# Altium project PCB_Project.PrjPcb
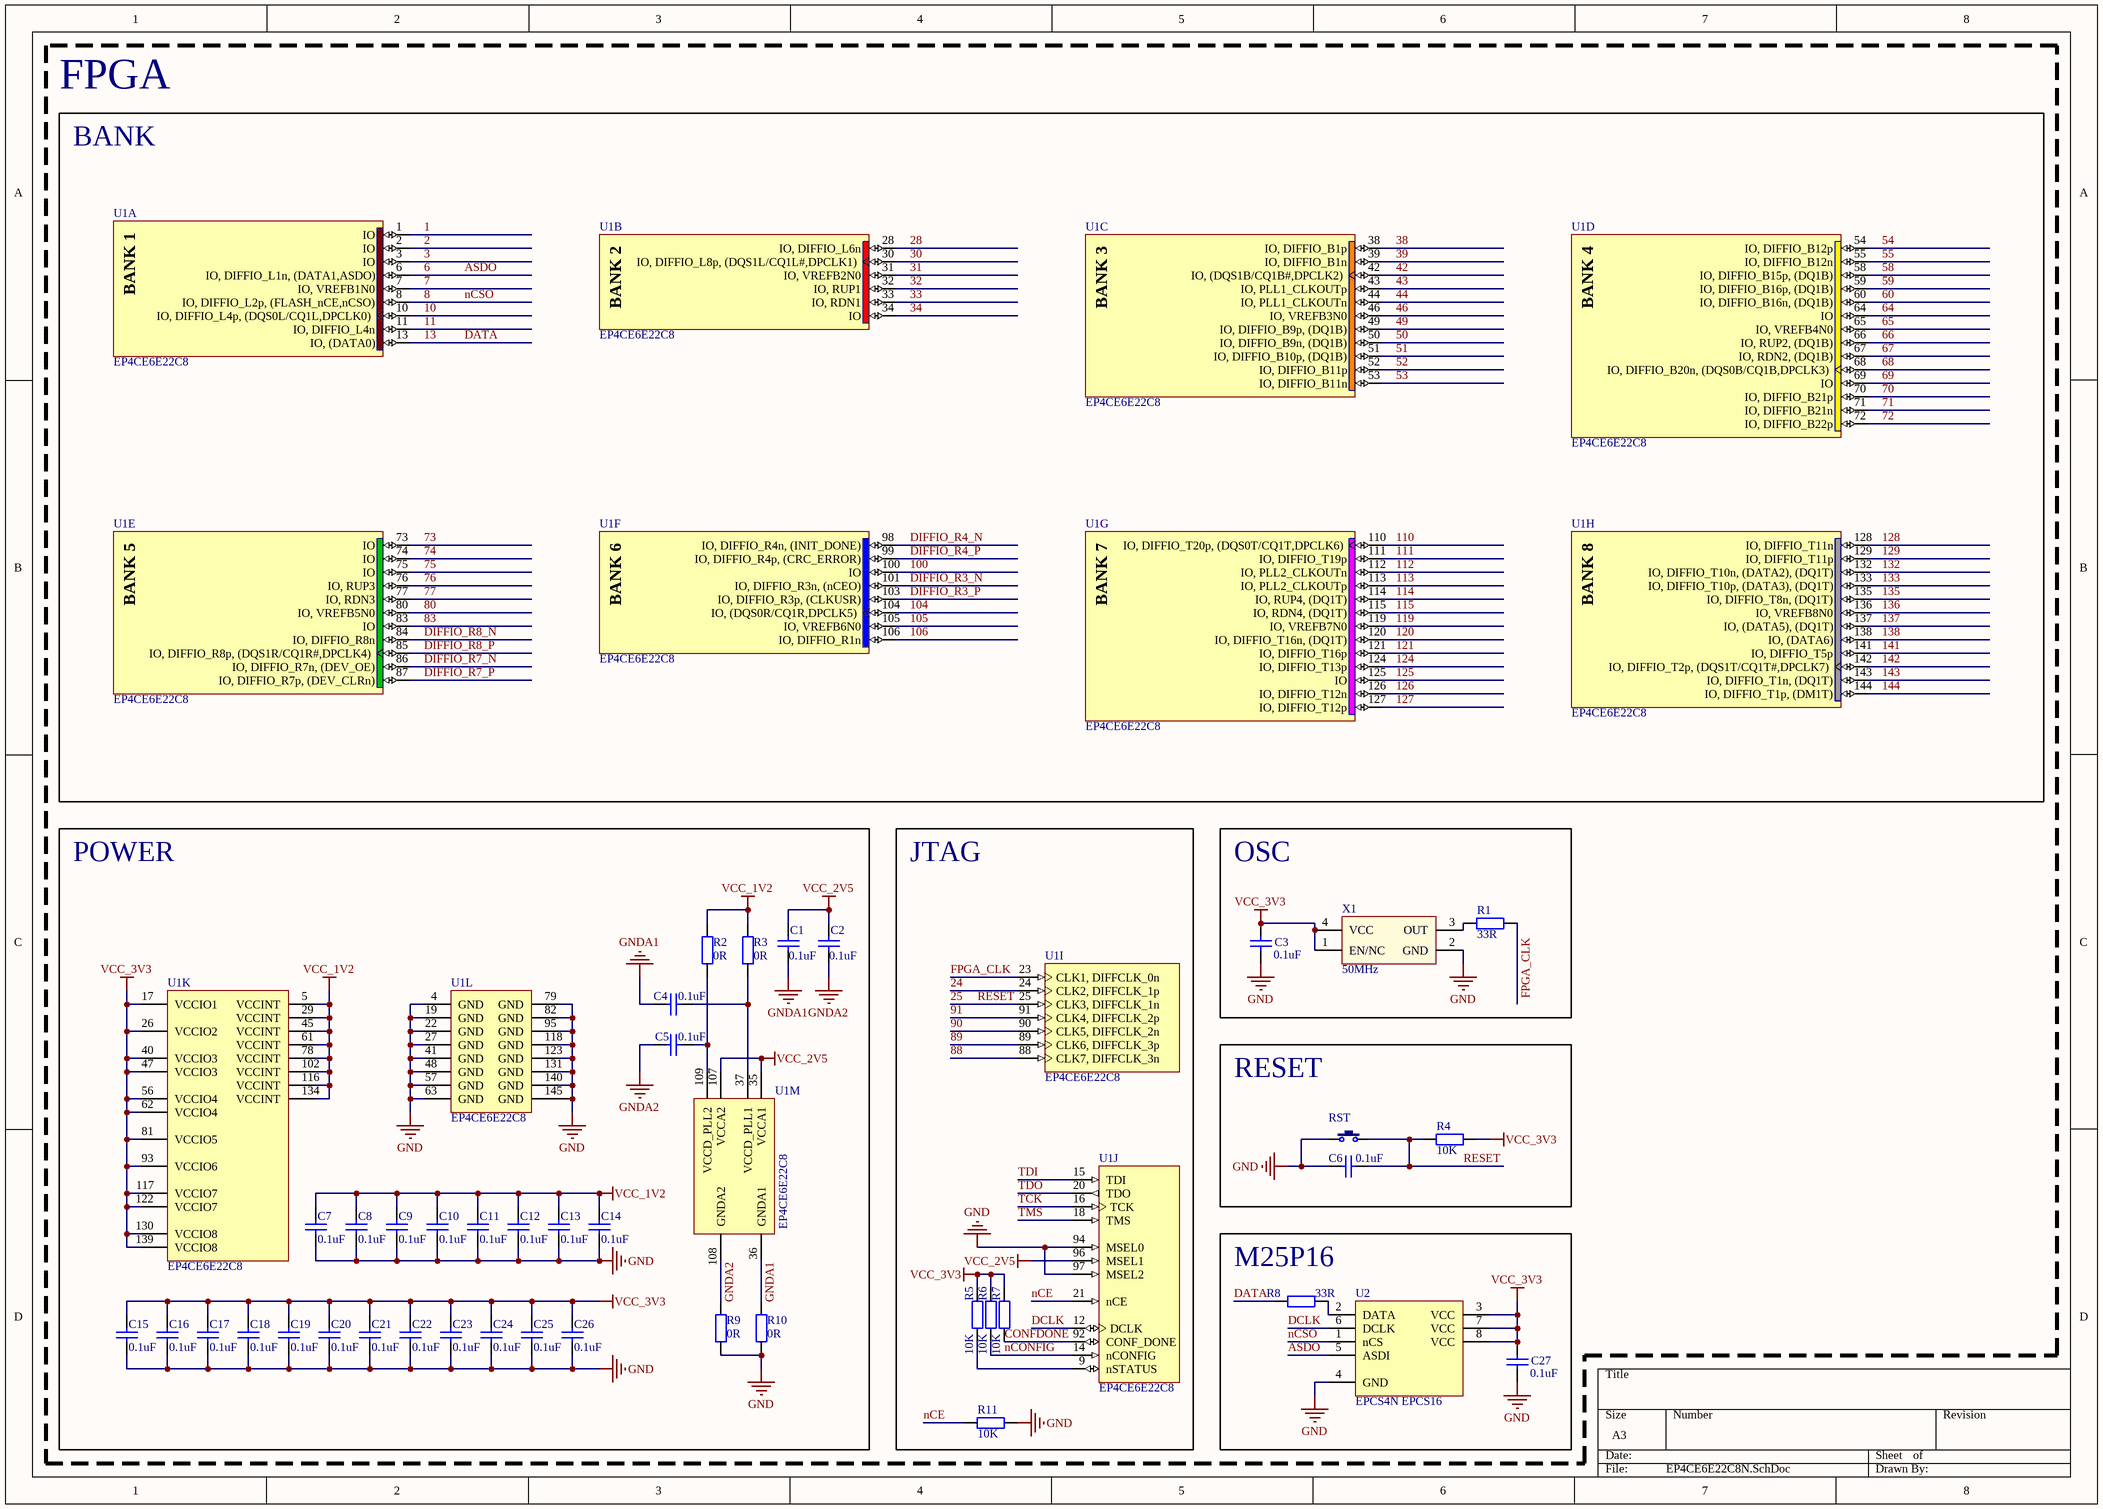
[diagram p0: EP4CE6E22C8N.SchDoc]
5 sheets, 156 parts. Net scope: global (net labels, ports and power ports of the same name join across sheets).
Board file: FPGA_PCB.PcbDoc
Sheets:
  EP4CE6E22C8N.SchDoc
  DDR_HDMI.SchDoc
  Power.SchDoc
  USB_Blaster.SchDoc
  Peripheral.SchDoc

## Sheet EP4CE6E22C8N.SchDoc
size A3; SheetNumber: 1; SheetTotal: 5

### Parts
C1  0.1uF  [0402_C]
C2  0.1uF  [0402_C]
C3  0.1uF  [0402_C]
C4  0.1uF  [0402_C]
C5  0.1uF  [0402_C]
C6  0.1uF  [0402_C]
C7  0.1uF  [0402_C]
C8  0.1uF  [0402_C]
C9  0.1uF  [0402_C]
C10  0.1uF  [0402_C]
C11  0.1uF  [0402_C]
C12  0.1uF  [0402_C]
C13  0.1uF  [0402_C]
C14  0.1uF  [0402_C]
C15  0.1uF  [0402_C]
C16  0.1uF  [0402_C]
C17  0.1uF  [0402_C]
C18  0.1uF  [0402_C]
C19  0.1uF  [0402_C]
C20  0.1uF  [0402_C]
C21  0.1uF  [0402_C]
C22  0.1uF  [0402_C]
C23  0.1uF  [0402_C]
C24  0.1uF  [0402_C]
C25  0.1uF  [0402_C]
C26  0.1uF  [0402_C]
C27  0.1uF  [0402_C]
R1  33R  [0402_R]
R2  0R  [0603_R _MINI]
R3  0R  [0603_R _MINI]
R4  10K  [0402_R]
R5  10K  [0402_R]
R6  10K  [0402_R]
R7  10K  [0402_R]
R8  33R  [0402_R]
R9  0R  [0603_R _MINI]
R10  0R  [0603_R _MINI]
R11  10K  [0402_R]
RST  3x6x5  [SW]  (value not drawn)
U1  EP4CE6E22C8  [EQFP144 20X20_N]  (parts A,B,C,D,E,F,G,H,I,J,K,L,M of 13)
U2  EPCS4N EPCS16  [SOP8_M]
X1  50MHz  [OSC 7050-4P]

### Blocks framed on the sheet
FPGA: U1
POWER: C1 C2 C4 C5 C7-C26 R2 R3 R9 R10 U1
JTAG: R5-R7 R11 U1
OSC: C3 R1 X1
RESET: C6 R4 RST
M25P16: C27 R8 U2

### Nets
GND: C3.1 C6.1 C7.1 C8.1 C9.1 C10.1 C11.1 C12.1 C13.1 C14.1 C15.1 C16.1 C17.1 C18.1 C19.1 C20.1 C21.1 C22.1 C23.1 C24.1 C25.1 C26.1 C27.1 R9.2 R10.2 R11.2 RST.1 U1.4(GND) U1.19(GND) U1.22(GND) U1.27(GND) U1.41(GND) U1.48(GND) U1.57(GND) U1.63(GND) U1.79(GND) U1.82(GND) U1.94(MSEL0) U1.95(GND) U1.97(MSEL2) U1.118(GND) U1.123(GND) U1.131(GND) U1.140(GND) U1.145(GND) U2.4(GND) X1.2(GND)
GNDA1: C1.1 C4.1 R10.1 U1.36(GNDA1)
GNDA2: C2.1 C5.1 R9.1 U1.108(GNDA2)
VCC_1V2: C7.2 C8.2 C9.2 C10.2 C11.2 C12.2 C13.2 C14.2 R2.1 R3.1 U1.5(VCCINT) U1.29(VCCINT) U1.45(VCCINT) U1.61(VCCINT) U1.78(VCCINT) U1.102(VCCINT) U1.116(VCCINT) U1.134(VCCINT)
VCC_2V5: C1.2 C2.2 U1.35(VCCA1) U1.96(MSEL1) U1.107(VCCA2)
VCC_3V3: C3.2 C15.2 C16.2 C17.2 C18.2 C19.2 C20.2 C21.2 C22.2 C23.2 C24.2 C25.2 C26.2 C27.2 R4.2 R5.1 R6.1 R7.1 U1.17(VCCIO1) U1.26(VCCIO2) U1.40(VCCIO3) U1.47(VCCIO3) U1.56(VCCIO4) U1.62(VCCIO4) U1.81(VCCIO5) U1.93(VCCIO6) U1.117(VCCIO7) U1.122(VCCIO7) U1.130(VCCIO8) U1.139(VCCIO8) U2.3(VCC) U2.7(VCC) U2.8(VCC) X1.1(EN/NC) X1.4(VCC)
1: U1.1(IO)
2: U1.2(IO)
3: U1.3(IO)
6: U1.6(IO,_DIFFIO_L1n,_(DATA1,ASDO)) U2.5(ASDI)  [also labelled ASDO]
7: U1.7(IO,_VREFB1N0)
8: U1.8(IO,_DIFFIO_L2p,_(FLASH_nCE,nCSO)) U2.1(nCS)  [also labelled nCSO]
10: U1.10(IO,_DIFFIO_L4p,_(DQS0L/CQ1L,DPCLK0))
11: U1.11(IO,_DIFFIO_L4n)
13: R8.1 U1.13(IO,_(DATA0))  [also labelled DATA]
24: U1.24(CLK2,_DIFFCLK_1p)
25: C6.2 R4.1 RST.2 U1.25(CLK3,_DIFFCLK_1n)  [also labelled RESET]
28: U1.28(IO,_DIFFIO_L6n)
30: U1.30(IO,_DIFFIO_L8p,_(DQS1L/CQ1L#,DPCLK1))
31: U1.31(IO,_VREFB2N0)
32: U1.32(IO,_RUP1)
33: U1.33(IO,_RDN1)
34: U1.34(IO)
38: U1.38(IO,_DIFFIO_B1p)
39: U1.39(IO,_DIFFIO_B1n)
42: U1.42(IO,_(DQS1B/CQ1B#,DPCLK2))
43: U1.43(IO,_PLL1_CLKOUTp)
44: U1.44(IO,_PLL1_CLKOUTn)
46: U1.46(IO,_VREFB3N0)
49: U1.49(IO,_DIFFIO_B9p,_(DQ1B))
50: U1.50(IO,_DIFFIO_B9n,_(DQ1B))
51: U1.51(IO,_DIFFIO_B10p,_(DQ1B))
52: U1.52(IO,_DIFFIO_B11p)
53: U1.53(IO,_DIFFIO_B11n)
54: U1.54(IO,_DIFFIO_B12p)
55: U1.55(IO,_DIFFIO_B12n)
58: U1.58(IO,_DIFFIO_B15p,_(DQ1B))
59: U1.59(IO,_DIFFIO_B16p,_(DQ1B))
60: U1.60(IO,_DIFFIO_B16n,_(DQ1B))
64: U1.64(IO)
65: U1.65(IO,_VREFB4N0)
66: U1.66(IO,_RUP2,_(DQ1B))
67: U1.67(IO,_RDN2,_(DQ1B))
68: U1.68(IO,_DIFFIO_B20n,_(DQS0B/CQ1B,DPCLK3))
69: U1.69(IO)
70: U1.70(IO,_DIFFIO_B21p)
71: U1.71(IO,_DIFFIO_B21n)
72: U1.72(IO,_DIFFIO_B22p)
73: U1.73(IO)
74: U1.74(IO)
75: U1.75(IO)
76: U1.76(IO,_RUP3)
77: U1.77(IO,_RDN3)
80: U1.80(IO,_VREFB5N0)
83: U1.83(IO)
88: U1.88(CLK7,_DIFFCLK_3n)
89: U1.89(CLK6,_DIFFCLK_3p)
90: U1.90(CLK5,_DIFFCLK_2n)
91: U1.91(CLK4,_DIFFCLK_2p)
100: U1.100(IO)
104: U1.104(IO,_(DQS0R/CQ1R,DPCLK5))
105: U1.105(IO,_VREFB6N0)
106: U1.106(IO,_DIFFIO_R1n)
110: U1.110(IO,_DIFFIO_T20p,_(DQS0T/CQ1T,DPCLK6))
111: U1.111(IO,_DIFFIO_T19p)
112: U1.112(IO,_PLL2_CLKOUTn)
113: U1.113(IO,_PLL2_CLKOUTp)
114: U1.114(IO,_RUP4,_(DQ1T))
115: U1.115(IO,_RDN4,_(DQ1T))
119: U1.119(IO,_VREFB7N0)
120: U1.120(IO,_DIFFIO_T16n,_(DQ1T))
121: U1.121(IO,_DIFFIO_T16p)
124: U1.124(IO,_DIFFIO_T13p)
125: U1.125(IO)
126: U1.126(IO,_DIFFIO_T12n)
127: U1.127(IO,_DIFFIO_T12p)
128: U1.128(IO,_DIFFIO_T11n)
129: U1.129(IO,_DIFFIO_T11p)
132: U1.132(IO,_DIFFIO_T10n,_(DATA2),_(DQ1T))
133: U1.133(IO,_DIFFIO_T10p,_(DATA3),_(DQ1T))
135: U1.135(IO,_DIFFIO_T8n,_(DQ1T))
136: U1.136(IO,_VREFB8N0)
137: U1.137(IO,_(DATA5),_(DQ1T))
138: U1.138(IO,_(DATA6))
141: U1.141(IO,_DIFFIO_T5p)
142: U1.142(IO,_DIFFIO_T2p,_(DQS1T/CQ1T#,DPCLK7))
143: U1.143(IO,_DIFFIO_T1n,_(DQ1T))
144: U1.144(IO,_DIFFIO_T1p,_(DM1T))
CONFDONE: R7.2 U1.92(CONF_DONE)
DCLK: U1.12(DCLK) U2.6(DCLK)
DIFFIO_R3_N: U1.101(IO,_DIFFIO_R3n,_(nCEO))
DIFFIO_R3_P: U1.103(IO,_DIFFIO_R3p,_(CLKUSR))
DIFFIO_R4_N: U1.98(IO,_DIFFIO_R4n,_(INIT_DONE))
DIFFIO_R4_P: U1.99(IO,_DIFFIO_R4p,_(CRC_ERROR))
DIFFIO_R7_N: U1.86(IO,_DIFFIO_R7n,_(DEV_OE))
DIFFIO_R7_P: U1.87(IO,_DIFFIO_R7p,_(DEV_CLRn))
DIFFIO_R8_N: U1.84(IO,_DIFFIO_R8n)
DIFFIO_R8_P: U1.85(IO,_DIFFIO_R8p,_(DQS1R/CQ1R#,DPCLK4))
FPGA_CLK: R1.2 U1.23(CLK1,_DIFFCLK_0n)
nCE: R11.1 U1.21(nCE)
nCONFIG: R6.2 U1.14(nCONFIG)
TCK: U1.16(TCK)  [project net JTAG_TCK]
TDI: U1.15(TDI)  [project net JTAG_TDI]
TDO: U1.20(TDO)  [project net JTAG_TDO]
TMS: U1.18(TMS)  [project net JTAG_TMS]
NetC4_2: C4.2 R3.2 U1.37(VCCD_PLL1)
NetC5_2: C5.2 R2.2 U1.109(VCCD_PLL2)
NetR1_1: R1.1 X1.3(OUT)
NetR5_2: R5.2 U1.9(nSTATUS)
NetR8_2: R8.2 U2.2(DATA)

### Notes on the sheet
- BANK
- (in symbol EP4CE6E22C8, part A) BANK 1
- (in symbol EP4CE6E22C8, part B) BANK 2
- (in symbol EP4CE6E22C8, part C) BANK 3
- (in symbol EP4CE6E22C8, part D) BANK 4
- (in symbol EP4CE6E22C8, part E) BANK 5
- (in symbol EP4CE6E22C8, part F) BANK 6
- (in symbol EP4CE6E22C8, part G) BANK 7
- (in symbol EP4CE6E22C8, part H) BANK 8

### Library data of the parts
C1-C27 = 0402_C: 贴片电容; ComponentLink1Description: 供应商链接; ComponentLink1URL: http://www.szlcsc.com/product/details_1928.html; Package: 0402; Supplier: LC; SuppliersPartNumber: C1576
R1 R4-R8 R11 = 0402_R: 贴片电阻; ComponentLink1Description: 供应商链接; ComponentLink1URL: http://www.szlcsc.com/product/details_26667.html; Package: 0402; Supplier: LC; SuppliersPartNumber: C25924
R2 R3 R9 R10 = 0603_R_MINI: 贴片电阻; ComponentLink1Description: 供应商链接; ComponentLink1URL: http://www.szlcsc.com/product/details_23987.html; Package: 0603; Supplier: LC; SuppliersPartNumber: C23260
RST = TSW 3x6: 3x6轻触开关; 版权归属: 源创客; BOM名称: 3x6轻触开关; 学习资源: www.ooocke.com
U1 = EP4CE6E22C8: Cyclone IV Family FPGA, 2V Core, 91 I/O Pins, 2 PLLs, 144-Pin QFP, Speed Grade 8, Commercial Grade; Published: 3-May-2010; DatasheetVersion: ver1.2, Mar-2010; PackageVersion: ver16.0, Dec-2009; PackageReference: EQFP144; Publisher: Altium Limited; PackageDescription: 144-Pin Plastic Enhanced Quad Flat Pack (EQFP144) - Wire Bond; Code_JEDEC: MS-026-BFB; ComponentLink1Description: Manufacturer Link; ComponentLink1URL: http://www.altera.com/; ComponentLink2Description: Handbook; ComponentLink2URL: http://www.altera.com/literature/hb/cyclone-iv/cyclone4-handbook.pdf; ComponentLink3Description: Pinout Specification; ComponentLink3URL: http://www.altera.com/literature/lit-dp.jsp?category=cyc%204&showspreadsheet=y; ComponentLink4Description: Packaging Specification; ComponentLink4URL: http://www.altera.com/literature/ds/dspkg.pdf
U2 = EPCS1
X1 = XTAL-ACT-4P: 4脚有源晶振; 版权归属: 源创客; BOM名称: 4脚有源晶振; 学习资源: www.ooocke.com

## Sheet DDR_HDMI.SchDoc
size A4; SheetNumber: 2; SheetTotal: 5
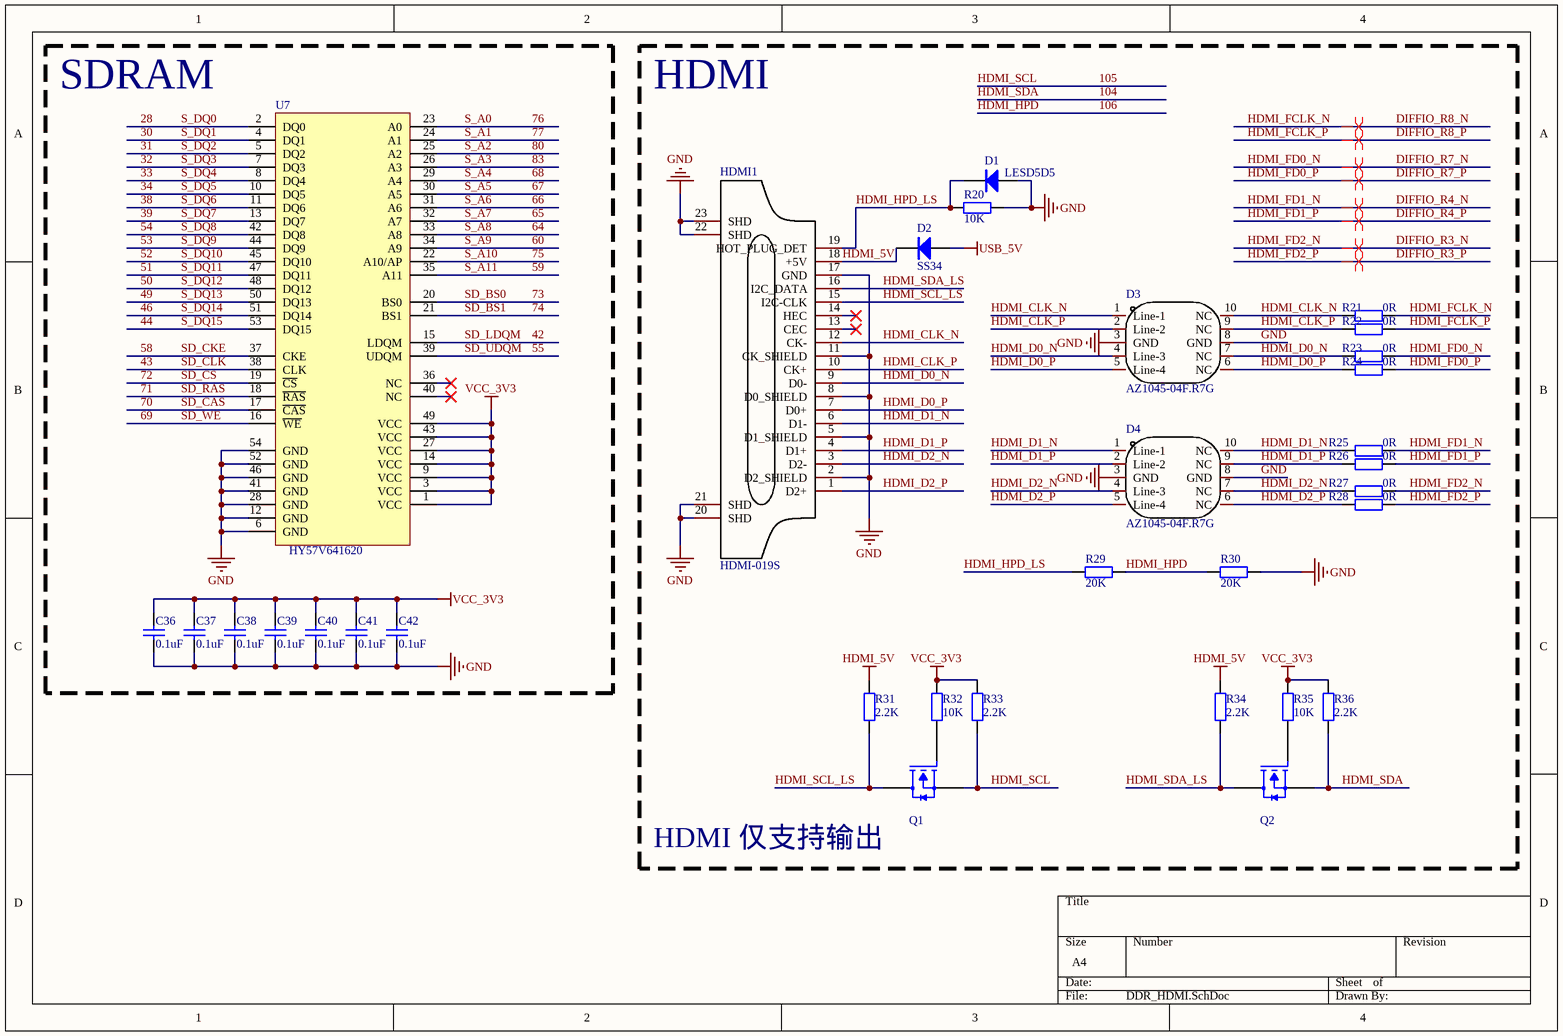
[diagram p1: DDR_HDMI.SchDoc]

### Parts
C36  0.1uF  [0402_C]
C37  0.1uF  [0402_C]
C38  0.1uF  [0402_C]
C39  0.1uF  [0402_C]
C40  0.1uF  [0402_C]
C41  0.1uF  [0402_C]
C42  0.1uF  [0402_C]
D1  LESD5D5  [SOD-523_L1.2-W0.8-LS1.6-RD]
D2  SS34  [SMC]
D3  AZ1045-04F.R7G  [DFN2510-10_L2.5-W1.0-P0.50-BL]
D4  AZ1045-04F.R7G  [DFN2510-10_L2.5-W1.0-P0.50-BL]
HDMI1  HDMI-019S  [HDMI-SMD_HDMI-019S]
Q1  AO3400A  [SOT23-3]  (value not drawn)
Q2  AO3400A  [SOT23-3]  (value not drawn)
R20  10K  [0402_R]
R21  0R  [0402_R]
R22  0R  [0402_R]
R23  0R  [0402_R]
R24  0R  [0402_R]
R25  0R  [0402_R]
R26  0R  [0402_R]
R27  0R  [0402_R]
R28  0R  [0402_R]
R29  20K  [0402_R]
R30  20K  [0402_R]
R31  2.2K  [0402_R]
R32  10K  [0402_R]
R33  2.2K  [0402_R]
R34  2.2K  [0402_R]
R35  10K  [0402_R]
R36  2.2K  [0402_R]
U7  HY57V641620  [TSOP-54_L22.2-W10.2-P0.80-LS11.8-BL]  (value not drawn)

### Blocks framed on the sheet
SDRAM: C36-C42 U7
HDMI: D1-D4 HDMI1 Q1 Q2 R20-R36

### Nets
GND: C36.1 C37.1 C38.1 C39.1 C40.1 C41.1 C42.1 D1.1(A) D3.3(GND) D3.8(GND) D4.3(GND) D4.8(GND) HDMI1.2(D2_SHIELD) HDMI1.5(D1_SHIELD) HDMI1.8(D0_SHIELD) HDMI1.11(CK_SHIELD) HDMI1.17(GND) HDMI1.20(SHD) HDMI1.21(SHD) HDMI1.22(SHD) HDMI1.23(SHD) R20.2 R30.2 U7.6(GND) U7.12(GND) U7.28(GND) U7.41(GND) U7.46(GND) U7.52(GND) U7.54(GND)
HDMI_5V: D2.2(K) HDMI1.18(+5V) R31.2 R34.2
USB_5V: D2.1(A)
VCC_3V3: C36.2 C37.2 C38.2 C39.2 C40.2 C41.2 C42.2 R32.2 R33.2 R35.2 R36.2 U7.1(VCC) U7.3(VCC) U7.9(VCC) U7.14(VCC) U7.27(VCC) U7.43(VCC) U7.49(VCC)
28: U7.2(DQ0)  [also labelled S_DQ0]
30: U7.4(DQ1)  [also labelled S_DQ1]
31: U7.5(DQ2)  [also labelled S_DQ2]
32: U7.7(DQ3)  [also labelled S_DQ3]
33: U7.8(DQ4)  [also labelled S_DQ4]
34: U7.10(DQ5)  [also labelled S_DQ5]
38: U7.11(DQ6)  [also labelled S_DQ6]
39: U7.13(DQ7)  [also labelled S_DQ7]
42: U7.15(LDQM)  [also labelled SD_LDQM]
43: U7.38(CLK)  [also labelled SD_CLK]
44: U7.53(DQ15)  [also labelled S_DQ15]
46: U7.51(DQ14)  [also labelled S_DQ14]
49: U7.50(DQ13)  [also labelled S_DQ13]
50: U7.48(DQ12)  [also labelled S_DQ12]
51: U7.47(DQ11)  [also labelled S_DQ11]
52: U7.45(DQ10)  [also labelled S_DQ10]
53: U7.44(DQ9)  [also labelled S_DQ9]
54: U7.42(DQ8)  [also labelled S_DQ8]
55: U7.39(UDQM)  [also labelled SD_UDQM]
58: U7.37(CKE)  [also labelled SD_CKE]
59: U7.35(A11)  [also labelled S_A11]
60: U7.34(A9)  [also labelled S_A9]
64: U7.33(A8)  [also labelled S_A8]
65: U7.32(A7)  [also labelled S_A7]
66: U7.31(A6)  [also labelled S_A6]
67: U7.30(A5)  [also labelled S_A5]
68: U7.29(A4)  [also labelled S_A4]
69: U7.16(~{WE})  [also labelled SD_WE]
70: U7.17(~{CAS})  [also labelled SD_CAS]
71: U7.18(~{RAS})  [also labelled SD_RAS]
72: U7.19(~{CS})  [also labelled SD_CS]
73: U7.20(BS0)  [also labelled SD_BS0]
74: U7.21(BS1)  [also labelled SD_BS1]
75: U7.22(A10/AP)  [also labelled S_A10]
76: U7.23(A0)  [also labelled S_A0]
77: U7.24(A1)  [also labelled S_A1]
80: U7.25(A2)  [also labelled S_A2]
83: U7.26(A3)  [also labelled S_A3]
104: Q2.2(S) R36.1  [also labelled HDMI_SDA]
105: Q1.2(S) R33.1  [also labelled HDMI_SCL]
106: R29.2 R30.1  [also labelled HDMI_HPD]
DIFFIO_R3_N: R27.2  [also labelled HDMI_FD2_N]
DIFFIO_R3_P: R28.2  [also labelled HDMI_FD2_P]
DIFFIO_R4_N: R25.2  [also labelled HDMI_FD1_N]
DIFFIO_R4_P: R26.2  [also labelled HDMI_FD1_P]
DIFFIO_R7_N: R23.2  [also labelled HDMI_FD0_N]
DIFFIO_R7_P: R24.2  [also labelled HDMI_FD0_P]
DIFFIO_R8_N: R21.2  [also labelled HDMI_FCLK_N]
DIFFIO_R8_P: R22.2  [also labelled HDMI_FCLK_P]
HDMI_CLK_N: D3.1(Line-1) D3.10(NC) HDMI1.12(CK-) R21.1
HDMI_CLK_P: D3.2(Line-2) D3.9(NC) HDMI1.10(CK+) R22.1
HDMI_D0_N: D3.4(Line-3) D3.7(NC) HDMI1.9(D0-) R23.1
HDMI_D0_P: D3.5(Line-4) D3.6(NC) HDMI1.7(D0+) R24.1
HDMI_D1_N: D4.1(Line-1) D4.10(NC) HDMI1.6(D1-) R25.1
HDMI_D1_P: D4.2(Line-2) D4.9(NC) HDMI1.4(D1+) R26.1
HDMI_D2_N: D4.4(Line-3) D4.7(NC) HDMI1.3(D2-) R27.1
HDMI_D2_P: D4.5(Line-4) D4.6(NC) HDMI1.1(D2+) R28.1
HDMI_HPD_LS: D1.2(K) HDMI1.19(HOT_PLUG_DET) R20.1 R29.1
HDMI_SCL_LS: HDMI1.15(I2C-CLK) Q1.3(D) R31.1
HDMI_SDA_LS: HDMI1.16(I2C_DATA) Q2.3(D) R34.1
NetQ1_1: Q1.1(G) R32.1
NetQ2_1: Q2.1(G) R35.1

Not connected (* = marked no-connect by the designer): HDMI1 13(CEC)* 14(HEC)*; U7 36(NC)* 40(NC)*

### Layout directives
differential pair: DIFFIO_R3_N, DIFFIO_R3_P, DIFFIO_R4_N, DIFFIO_R4_P, DIFFIO_R7_N, DIFFIO_R7_P, DIFFIO_R8_N, DIFFIO_R8_P

### Notes on the sheet
- HDMI 仅支持输出

### Library data of the parts
C36-C42 = 0402_C: 贴片电容; ComponentLink1Description: 供应商链接; ComponentLink1URL: http://www.szlcsc.com/product/details_1928.html; Package: 0402; Supplier: LC; SuppliersPartNumber: C1576
D1 = 1N5819: 肖特基二极管; 版权归属: 源创客; 属性: 40V/2A; BOM名称: 肖特基二极管; 学习资源: www.ooocke.com
D2 = SS34: 肖特基二极管; 版权归属: 源创客; 属性: 40V/3A; BOM名称: 肖特基二极管; 学习资源: www.ooocke.com
D3 D4 = AZ1045-04F.R7G: 反向截止电压(Vrwm):5V;击穿电压:6V;最大钳位电压:12V;; Manufacturer: AMAZING(晶焱); Add into BOM: yes; Reverse Stand-Off Voltage (Vrwm): 5V; Breakdown Voltage: 6V; Peak Pulse Current (Ipp)@10/1000μs: 3.5A@8/20us; Maximum Clamping Voltage: 12V; Symbol: AZ1045-04F.R7G; Device: AZ1045-04F.R7G; LCSC Part Name: AZ1045-04F.R7G; Supplier Part: C356811; Manufacturer Part: AZ1045-04F.R7G; Supplier Footprint: DFN-10(1x2.5); JLCPCB Part Class: Extended Part; Datasheet: https://atta.szlcsc.com/upload/public/pdf/source/20190802/C356811_0B9EAE80F3B7F983A0CAF91AEAB45A28.pdf; Supplier: LCSC; Convert to PCB: yes; Name: AZ1045-04F.R7G
HDMI1 = HDMI-019S: 连接器类型:HDMI;公母:母;总PIN位数:19;排数:-;安装方式:卧贴;额定电流:500mA;工作温度范围:-25℃~+75℃;; Manufacturer: SOFNG(硕方); Add into BOM: yes; Connector Type: HDMI; Gender: 母; Current Rating (Max): 500mA; Symbol: HDMI-019S; Device: HDMI-019S; LCSC Part Name: HDMI 母 P数:19; Supplier Part: C111617; Manufacturer Part: HDMI-019S; Supplier Footprint: SMD; JLCPCB Part Class: Extended Part; Datasheet: https://atta.szlcsc.com/upload/public/pdf/source/20200911/C111617_84DD1BD35B9EB8A28224A63520745D0A.pdf; Supplier: LCSC; Convert to PCB: yes; Number of Pins: 19; Number of Rows: -; Mounting Style: 卧贴; Operating Temperature Range: -25℃~+75℃; Name: HDMI-019S
Q1 Q2 = AO3400A: N-MOS
R20-R36 = 0402_R: 贴片电阻; ComponentLink1Description: 供应商链接; ComponentLink1URL: http://www.szlcsc.com/product/details_26667.html; Package: 0402; Supplier: LC; SuppliersPartNumber: C25924

## Sheet Power.SchDoc
size A4; SheetNumber: 3; SheetTotal: 5
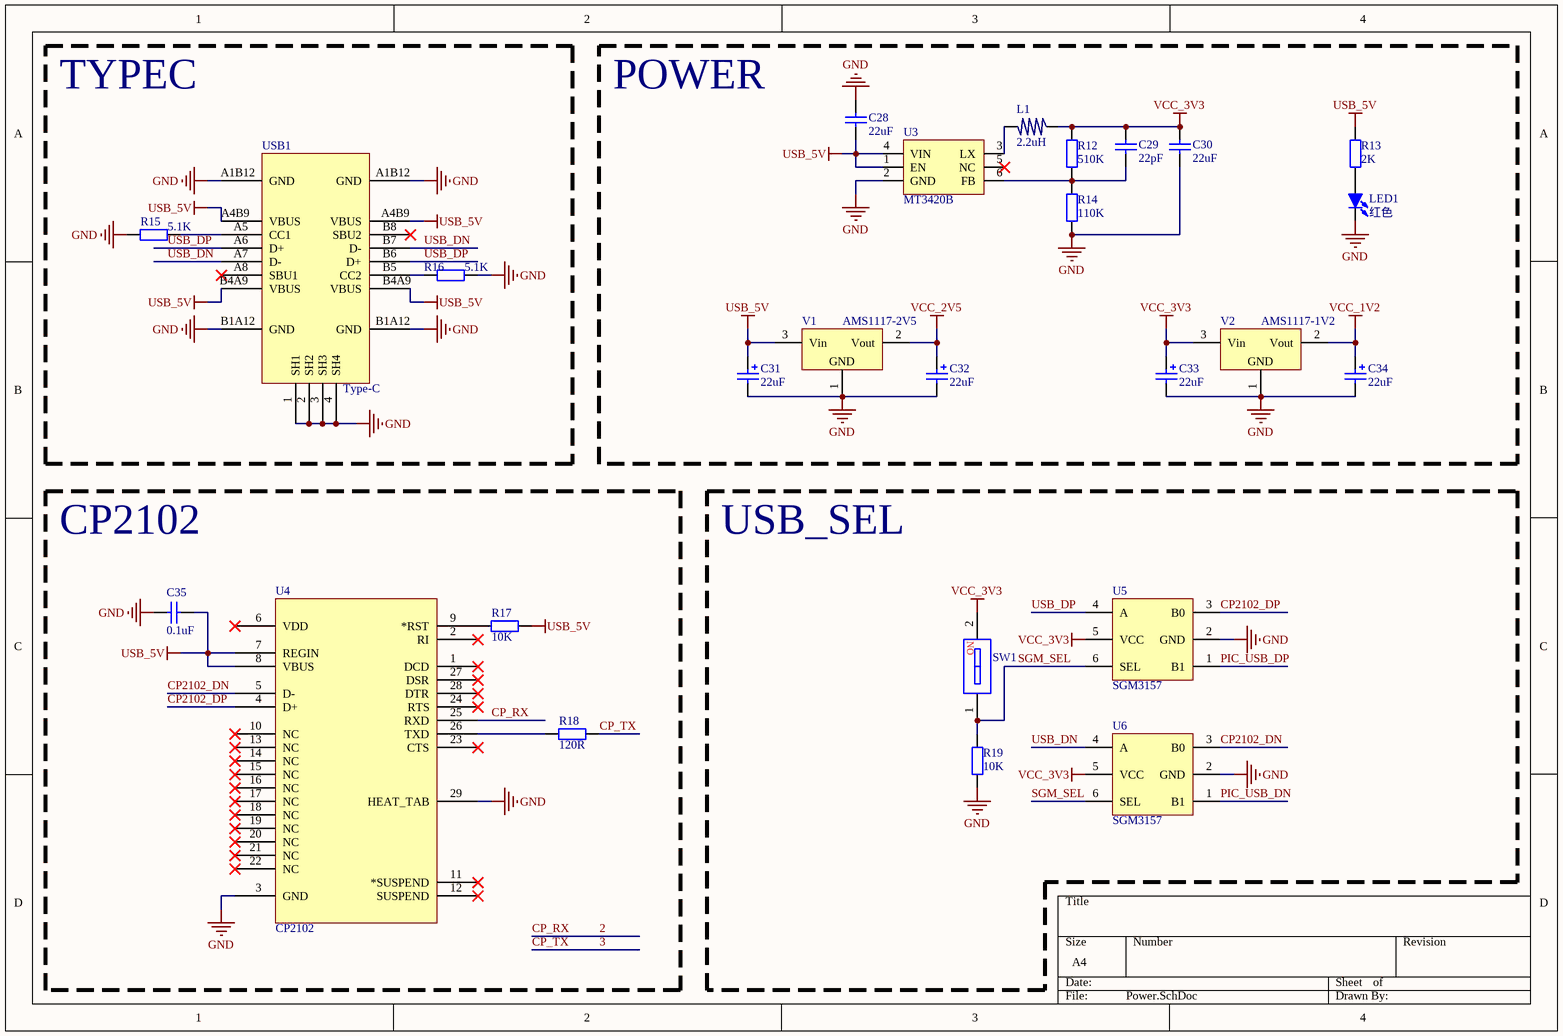
[diagram p2: Power.SchDoc]

### Parts
C28  22uF  [0603_C _MINI]
C29  22pF  [0402_C]
C30  22uF  [0603_C _MINI]
C31  22uF  [CASE-A_3216]
C32  22uF  [CASE-A_3216]
C33  22uF  [CASE-A_3216]
C34  22uF  [CASE-A_3216]
C35  0.1uF  [0402_C]
L1  2.2uH  [NR3015]
LED1  红色  [LED 0603R]
R12  510K  [0402_R]
R13  2K  [0402_R]
R14  110K  [0402_R]
R15  5.1K  [0402_R]
R16  5.1K  [0402_R]
R17  10K  [0402_R]
R18  120R  [0402_R]
R19  10K  [0402_R]
SW1  CSW-1P  [SW-SMD_DSIC01LSGET]  (value not drawn)
U3  MT3420B  [SOT23-6L]
U4  CP2102  [QFN28 5x5_N]
U5  SGM3157  [SC-70-6_L2.2-W1.3-P0.65-LS2.2-BR]
U6  SGM3157  [SC-70-6_L2.2-W1.3-P0.65-LS2.2-BR]
USB1  Type-C  [Type-C-TOP]
V1  AMS1117-2V5  [SOT89_N]
V2  AMS1117-1V2  [SOT89_N]

### Blocks framed on the sheet
TYPEC: R15 R16 USB1
POWER: C28-C34 L1 LED1 R12-R14 U3 V1 V2
CP2102: C35 R17 R18 U4
USB_SEL: R19 SW1 U5 U6

### Nets
GND: C28.2 C30.1 C31.2 C32.2 C33.2 C34.2 C35.2 LED1.2(K) R14.1 R15.1 R16.2 R19.1 U3.2(GND) U4.3(GND) U4.29(HEAT_TAB) U5.2(GND) U6.2(GND) USB1.1(SH1) USB1.2(SH2) USB1.3(SH3) USB1.4(SH4) USB1.A1B12(GND) USB1.B1A12(GND) V1.1(GND) V2.1(GND)
USB_5V: C28.1 C31.1 C35.1 R13.2 R17.2 U3.1(EN) U3.4(VIN) U4.7(REGIN) U4.8(VBUS) USB1.A4B9(VBUS) USB1.B4A9(VBUS) V1.3(Vin)
VCC_1V2: C34.1 V2.2(Vout)
VCC_2V5: C32.1 V1.2(Vout)
VCC_3V3: C29.2 C30.2 C33.1 L1.1 R12.2 SW1.2 U5.5(VCC) U6.5(VCC) V2.3(Vin)
2: U4.25(RXD)  [also labelled CP_RX]
3: R18.2  [also labelled CP_TX]
CP2102_DN: U4.5(D-) U6.3(B0)
CP2102_DP: U4.4(D+) U5.3(B0)
PIC_USB_DN: U6.1(B1)
PIC_USB_DP: U5.1(B1)
SGM_SEL: R19.2 SW1.1 U5.6(SEL) U6.6(SEL)
USB_DN: U6.4(A) USB1.A7(D-) USB1.B7(D-)
USB_DP: U5.4(A) USB1.A6(D+) USB1.B6(D+)
NetC29_1: C29.1 R12.1 R14.2 U3.6(FB)
NetL1_2: L1.2 U3.3(LX)
NetLED1_1: LED1.1(A) R13.1
NetR15_2: R15.2 USB1.A5(CC1)
NetR16_1: R16.1 USB1.B5(CC2)
NetR17_1: R17.1 U4.9(*RST)
NetR18_1: R18.1 U4.26(TXD)

Not connected (* = marked no-connect by the designer): U3 5(NC)*; U4 1(DCD)* 2(RI)* 6(VDD)* 10(NC)* 11(*SUSPEND)* 12(SUSPEND)* 13(NC)* 14(NC)* 15(NC)* 16(NC)* 17(NC)* 18(NC)* 19(NC)* 20(NC)* 21(NC)* 22(NC)* 23(CTS)* 24(RTS)* 27(DSR)* 28(DTR)*; USB1 A8(SBU1)* B8(SBU2)*

### Notes on the sheet
- (in symbol CSW-1P) NO

### Library data of the parts
C28 C30 = 0603_C_MINI: 贴片电容; ComponentLink1Description: 供应商链接; ComponentLink1URL: http://www.szlcsc.com/product/details_2037.html; Package: 0603; Supplier: LC; SuppliersPartNumber: C1685
C29 C35 = 0402_C: 贴片电容; ComponentLink1Description: 供应商链接; ComponentLink1URL: http://www.szlcsc.com/product/details_1928.html; Package: 0402; Supplier: LC; SuppliersPartNumber: C1576
C31-C34 = 3216_C: 贴片钽电容; ComponentLink1Description: 供应商链接; ComponentLink1URL: http://www.szlcsc.com/product/details_16815.html; Package: 3528; Supplier: LC; SuppliersPartNumber: C16133
L1 = L
LED1 = 0603_LED_R: 贴片LED; 版权归属: 源创客; BOM名称: 贴片LED; 学习资源: www.ooocke.com
R12-R19 = 0402_R: 贴片电阻; ComponentLink1Description: 供应商链接; ComponentLink1URL: http://www.szlcsc.com/product/details_26667.html; Package: 0402; Supplier: LC; SuppliersPartNumber: C25924
SW1 = CSW-1P: 1路编码开关; 版权归属: 源创客; BOM名称: 1路编码开关; 学习资源: www.ooocke.com
U3 = MT3420B: DCDC
U4 = CP2102: USB转TTL; PART DESC: SINGLE-CHIP USB TO UART BRIDGE, QFN28, RoHS.; MFG #1: SILICON LABS; PART NUMBER: CP2102; Value: Value; RefDes: RefDes; Type: DEV
U5 U6 = SGM3157: 模拟开关
USB1 = USB-Type-C-TOP
V1 V2 = AMS1117: 三端稳压芯片; BOM名称: 稳压芯片; 版权归属: 源创客; 学习资源: www.ooocke.com

## Sheet USB_Blaster.SchDoc
size A4; SheetNumber: 4; SheetTotal: 5
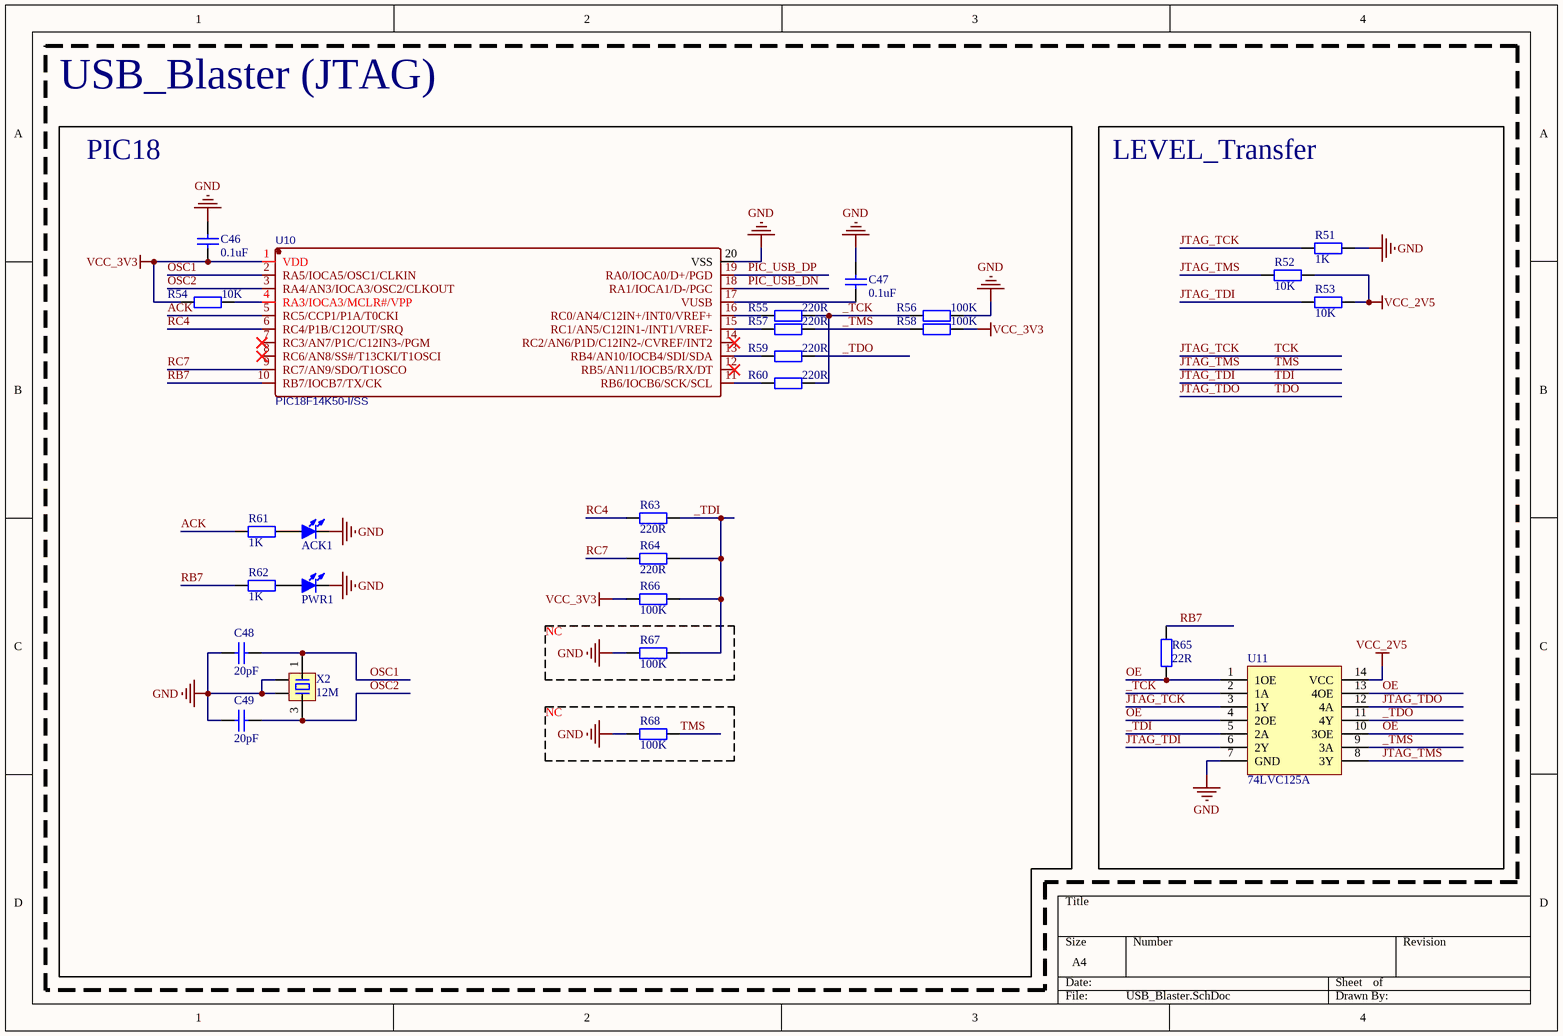
[diagram p3: USB_Blaster.SchDoc]

### Parts
ACK1  红色  [LED 0603G]  (value not drawn)
C46  0.1uF  [0402_C]
C47  0.1uF  [0402_C]
C48  20pF  [0402_C]
C49  20pF  [0402_C]
PWR1  红色  [LED 0603R]  (value not drawn)
R51  1K  [0402_R]
R52  10K  [0402_R]
R53  10K  [0402_R]
R54  10K  [0402_R]
R55  220R  [0402_R]
R56  100K  [0402_R]
R57  220R  [0402_R]
R58  100K  [0402_R]
R59  220R  [0402_R]
R60  220R  [0402_R]
R61  1K  [0402_R]
R62  1K  [0402_R]
R63  220R  [0402_R]
R64  220R  [0402_R]
R65  22R  [0402_R]
R66  100K  [0402_R]
R67  100K  [0402_R]
R68  100K  [0402_R]
U10  PIC18F14K50-I/SS  [SSOP20_L]
U11  74LVC125A  [TSSOP14_N]
X2  12M  [OSC 3225-4P]

### Blocks framed on the sheet
PIC18: ACK1 C46-C49 PWR1 R54-R64 R66 U10 X2
LEVEL_Transfer: R51-R53 R65 U11
NC: R67
NC: R68

### Nets
GND: ACK1.2(K) C46.2 C47.1 C48.1 C49.1 PWR1.2(K) R51.2 R56.2 R67.2 R68.2 U10.20(VSS) U11.7(GND) X2.2 X2.4
VCC_2V5: R52.2 R53.2 U11.14(VCC)
VCC_3V3: C46.1 R54.1 R58.2 R66.2 U10.1(VDD)
_TCK: R55.2 R56.1 R60.2 U11.2(1A)
_TDI: R63.2 R64.2 R66.1 R67.1 U11.5(2A)
_TDO: R59.2 U11.11(4Y)
_TMS: R57.2 R58.1 U11.9(3A)
ACK: R61.2 U10.5(RC5/CCP1/P1A/T0CKI)
JTAG_TCK: R51.1 U11.3(1Y)  [also labelled TCK]
JTAG_TDI: R53.1 U11.6(2Y)  [also labelled TDI]
JTAG_TDO: U11.12(4A)  [also labelled TDO]
JTAG_TMS: R52.1 R68.1 U11.8(3Y)  [also labelled TMS]
OE: R65.1 U11.1(1OE) U11.4(2OE) U11.10(3OE) U11.13(4OE)
OSC1: C48.2 U10.2(RA5/IOCA5/OSC1/CLKIN) X2.1
OSC2: C49.2 U10.3(RA4/AN3/IOCA3/OSC2/CLKOUT) X2.3
PIC_USB_DN: U10.18(RA1/IOCA1/D-/PGC)
PIC_USB_DP: U10.19(RA0/IOCA0/D+/PGD)
RB7: R62.2 R65.2 U10.10(RB7/IOCB7/TX/CK)
RC4: R63.1 U10.6(RC4/P1B/C12OUT/SRQ)
RC7: R64.1 U10.9(RC7/AN9/SDO/T1OSCO)
NetACK1_1: ACK1.1(A) R61.1
NetC47_2: C47.2 U10.17(VUSB)
NetPWR1_1: PWR1.1(A) R62.1
NetR54_2: R54.2 U10.4(RA3/IOCA3/MCLR#/VPP)
NetR55_1: R55.1 U10.16(RC0/AN4/C12IN+/INT0/VREF+)
NetR57_1: R57.1 U10.15(RC1/AN5/C12IN1-/INT1/VREF-)
NetR59_1: R59.1 U10.13(RB4/AN10/IOCB4/SDI/SDA)
NetR60_1: R60.1 U10.11(RB6/IOCB6/SCK/SCL)

Not connected (* = marked no-connect by the designer): U10 7(RC3/AN7/P1C/C12IN3-/PGM)* 8(RC6/AN8/SS#/T13CKI/T1OSCI)* 12(RB5/AN11/IOCB5/RX/DT)* 14(RC2/AN6/P1D/C12IN2-/CVREF/INT2)*

### Notes on the sheet
- USB_Blaster (JTAG)

### Library data of the parts
ACK1 = 0603_LED_G: 贴片LED; 版权归属: 源创客; BOM名称: 贴片LED; 学习资源: www.ooocke.com
C46-C49 = 0402_C: 贴片电容; ComponentLink1Description: 供应商链接; ComponentLink1URL: http://www.szlcsc.com/product/details_1928.html; Package: 0402; Supplier: LC; SuppliersPartNumber: C1576
PWR1 = 0603_LED_R: 贴片LED; 版权归属: 源创客; BOM名称: 贴片LED; 学习资源: www.ooocke.com
R51-R68 = 0402_R: 贴片电阻; ComponentLink1Description: 供应商链接; ComponentLink1URL: http://www.szlcsc.com/product/details_26667.html; Package: 0402; Supplier: LC; SuppliersPartNumber: C25924
U10 = PIC18F14K50-I/SS: BOM_Manufacturer: MICROCHIP; BOM_Supplier: LCSC; BOM_Manufacturer Part: PIC18F14K50-I/SS; BOM_Supplier Part: C12460; BOM_JLCPCB Part Class: Extended Part; spicePre: U; spiceSymbolName: PIC18F14K50-I/SS
X2 = XTAL-4P: 4脚无源晶振; 版权归属: 源创客; BOM名称: 4脚无源晶振; 学习资源: www.ooocke.com

## Sheet Peripheral.SchDoc
size A4; SheetNumber: 5; SheetTotal: 5
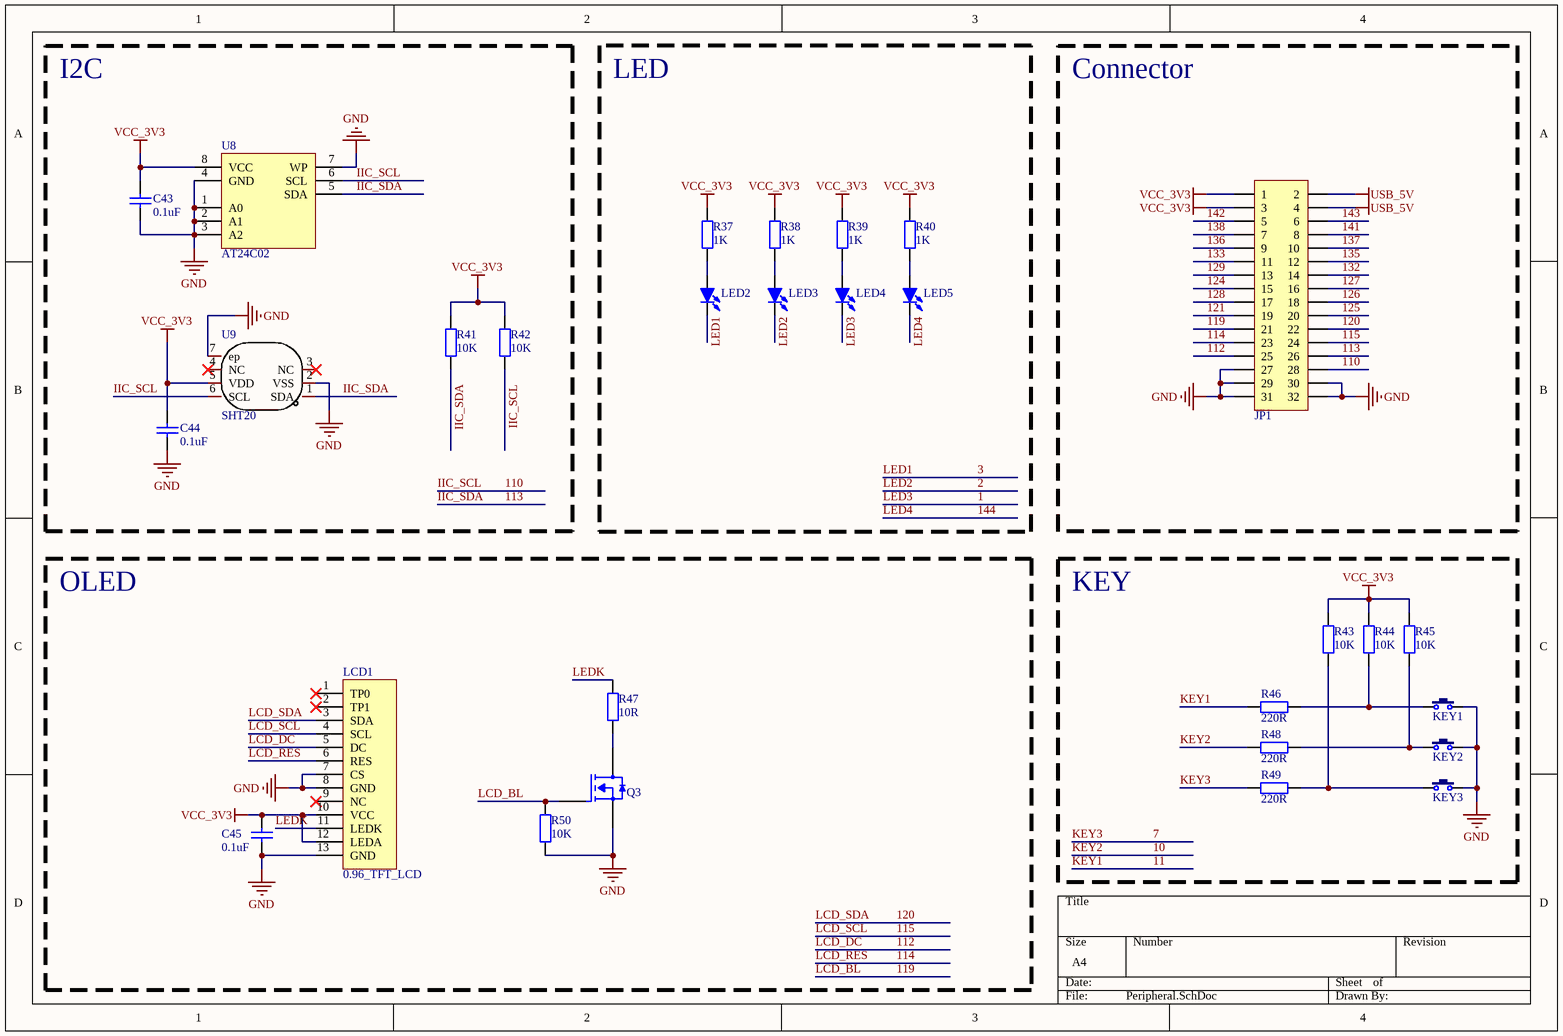
[diagram p4: Peripheral.SchDoc]

### Parts
C43  0.1uF  [0402_C]
C44  0.1uF  [0402_C]
C45  0.1uF  [0402_C]
JP1  Header 2X11  [HDR2.54-LI-2x16P]  (value not drawn)
KEY1  3x6x5  [SW]  (value not drawn)
KEY2  3x6x5  [SW]  (value not drawn)
KEY3  3x6x5  [SW]  (value not drawn)
LCD1  0.96_TFT_LCD  [0.78_TFT_LCD]
LED2  红色  [LED 0603B]  (value not drawn)
LED3  红色  [LED 0603G]  (value not drawn)
LED4  红色  [LED 0603R]  (value not drawn)
LED5  红色  [LED 0603R]  (value not drawn)
Q3  AO3400A  [SOT23-3]  (value not drawn)
R37  1K  [0402_R]
R38  1K  [0402_R]
R39  1K  [0402_R]
R40  1K  [0402_R]
R41  10K  [0402_R]
R42  10K  [0402_R]
R43  10K  [0402_R]
R44  10K  [0402_R]
R45  10K  [0402_R]
R46  220R  [0402_R]
R47  10R  [0402_R]
R48  220R  [0402_R]
R49  220R  [0402_R]
R50  10K  [0402_R]
U8  AT24C02  [SOP8_N]
U9  SHT20  [DFN-6_L3.0-W3.0-P0.95-TR-EP]

### Blocks framed on the sheet
I2C: C43 C44 R41 R42 U8 U9
LED: LED2-LED5 R37-R40
Connector: JP1
OLED: C45 LCD1 Q3 R47 R50
KEY: KEY1-KEY3 R43-R46 R48 R49

### Nets
GND: C43.1 C44.1 C45.1 JP1.27 JP1.29 JP1.30 JP1.31 JP1.32 KEY1.1 KEY2.1 KEY3.1 LCD1.7(CS) LCD1.8(GND) LCD1.13(GND) Q3.2(S) R50.1 U8.1(A0) U8.2(A1) U8.3(A2) U8.4(GND) U8.7(WP) U9.2(VSS) U9.7(ep)
USB_5V: JP1.2 JP1.4
VCC_3V3: C43.2 C44.2 C45.2 JP1.1 JP1.3 LCD1.10(VCC) LCD1.12(LEDA) R37.2 R38.2 R39.2 R40.2 R41.1 R42.1 R43.1 R44.2 R45.2 U8.8(VCC) U9.5(VDD)
1: LED4.2(K)  [also labelled LED3]
2: LED3.2(K)  [also labelled LED2]
3: LED2.2(K)  [also labelled LED1]
7: R49.2  [also labelled KEY3]
10: R48.2  [also labelled KEY2]
11: R46.2  [also labelled KEY1]
110: JP1.28 R42.2 U8.6(SCL) U9.6(SCL)  [also labelled IIC_SCL]
112: JP1.25 LCD1.5(DC)  [also labelled LCD_DC]
113: JP1.26 R41.2 U8.5(SDA) U9.1(SDA)  [also labelled IIC_SDA]
114: JP1.23 LCD1.6(RES)  [also labelled LCD_RES]
115: JP1.24 LCD1.4(SCL)  [also labelled LCD_SCL]
119: JP1.21 Q3.1(G) R50.2  [also labelled LCD_BL]
120: JP1.22 LCD1.3(SDA)  [also labelled LCD_SDA]
121: JP1.19
124: JP1.15
125: JP1.20
126: JP1.18
127: JP1.16
128: JP1.17
129: JP1.13
132: JP1.14
133: JP1.11
135: JP1.12
136: JP1.9
137: JP1.10
138: JP1.7
141: JP1.8
142: JP1.5
143: JP1.6
144: LED5.2(K)  [also labelled LED4]
LEDK: LCD1.11(LEDK) R47.2
NetKEY1_2: KEY1.2 R44.1 R46.1
NetKEY2_2: KEY2.2 R45.1 R48.1
NetKEY3_2: KEY3.2 R43.2 R49.1
NetLED2_1: LED2.1(A) R37.1
NetLED3_1: LED3.1(A) R38.1
NetLED4_1: LED4.1(A) R39.1
NetLED5_1: LED5.1(A) R40.1
NetQ3_3: Q3.3(D) R47.1

Not connected (* = marked no-connect by the designer): LCD1 1(TP0)* 2(TP1)* 9(NC)*; U9 3(NC)* 4(NC)*

### Library data of the parts
C43-C45 = 0402_C: 贴片电容; ComponentLink1Description: 供应商链接; ComponentLink1URL: http://www.szlcsc.com/product/details_1928.html; Package: 0402; Supplier: LC; SuppliersPartNumber: C1576
JP1 = Header 16X2_2.54: 16*2P接插件; 版权归属: 源创客; BOM名称: 16*2P接插件; 学习资源: www.ooocke.com
KEY1-KEY3 = TSW 3x6: 3x6轻触开关; 版权归属: 源创客; BOM名称: 3x6轻触开关; 学习资源: www.ooocke.com
LED2 = 0603_LED_B: 贴片LED; 版权归属: 源创客; BOM名称: 贴片LED; 学习资源: www.ooocke.com
LED3 = 0603_LED_G: 贴片LED; 版权归属: 源创客; BOM名称: 贴片LED; 学习资源: www.ooocke.com
LED4 LED5 = 0603_LED_R: 贴片LED; 版权归属: 源创客; BOM名称: 贴片LED; 学习资源: www.ooocke.com
Q3 = AO3400A: N-MOS
R37-R50 = 0402_R: 贴片电阻; ComponentLink1Description: 供应商链接; ComponentLink1URL: http://www.szlcsc.com/product/details_26667.html; Package: 0402; Supplier: LC; SuppliersPartNumber: C25924
U9 = SHT20: I2C接口，数字式温湿度传感器，电压范围: 2.1至3.6 V; Manufacturer: Sensirion(瑞士盛思锐); Add into BOM: yes; Symbol: SHT20; Device: SHT20; LCSC Part Name: SHT20; Supplier Part: C53865; Manufacturer Part: SHT20; Supplier Footprint: DFN-6-EP(3x3); JLCPCB Part Class: Extended Part; Datasheet: https://atta.szlcsc.com/upload/public/pdf/source/20151012/1457707445424.pdf; Supplier: LCSC; Convert to PCB: yes; Name: SHT20

## Nets that join several sheets
GND: EP4CE6E22C8N (47 pins), DDR_HDMI (30 pins), Power (25 pins), USB_Blaster (14 pins), Peripheral (23 pins)
USB_5V: DDR_HDMI (D2.1), Power (12 pins), Peripheral (JP1.2 JP1.4)
VCC_1V2: EP4CE6E22C8N (18 pins), Power (C34.1 V2.2)
VCC_2V5: EP4CE6E22C8N (5 pins), Power (C32.1 V1.2), USB_Blaster (R52.2 R53.2 U11.14)
VCC_3V3: EP4CE6E22C8N (35 pins), DDR_HDMI (18 pins), Power (9 pins), USB_Blaster (5 pins), Peripheral (18 pins)
1: EP4CE6E22C8N (U1.1), Peripheral (LED4.2)
2: EP4CE6E22C8N (U1.2), Power (U4.25), Peripheral (LED3.2)
3: EP4CE6E22C8N (U1.3), Power (R18.2), Peripheral (LED2.2)
7: EP4CE6E22C8N (U1.7), Peripheral (R49.2)
10: EP4CE6E22C8N (U1.10), Peripheral (R48.2)
11: EP4CE6E22C8N (U1.11), Peripheral (R46.2)
28: EP4CE6E22C8N (U1.28), DDR_HDMI (U7.2)
30: EP4CE6E22C8N (U1.30), DDR_HDMI (U7.4)
31: EP4CE6E22C8N (U1.31), DDR_HDMI (U7.5)
32: EP4CE6E22C8N (U1.32), DDR_HDMI (U7.7)
33: EP4CE6E22C8N (U1.33), DDR_HDMI (U7.8)
34: EP4CE6E22C8N (U1.34), DDR_HDMI (U7.10)
38: EP4CE6E22C8N (U1.38), DDR_HDMI (U7.11)
39: EP4CE6E22C8N (U1.39), DDR_HDMI (U7.13)
42: EP4CE6E22C8N (U1.42), DDR_HDMI (U7.15)
43: EP4CE6E22C8N (U1.43), DDR_HDMI (U7.38)
44: EP4CE6E22C8N (U1.44), DDR_HDMI (U7.53)
46: EP4CE6E22C8N (U1.46), DDR_HDMI (U7.51)
49: EP4CE6E22C8N (U1.49), DDR_HDMI (U7.50)
50: EP4CE6E22C8N (U1.50), DDR_HDMI (U7.48)
51: EP4CE6E22C8N (U1.51), DDR_HDMI (U7.47)
52: EP4CE6E22C8N (U1.52), DDR_HDMI (U7.45)
53: EP4CE6E22C8N (U1.53), DDR_HDMI (U7.44)
54: EP4CE6E22C8N (U1.54), DDR_HDMI (U7.42)
55: EP4CE6E22C8N (U1.55), DDR_HDMI (U7.39)
58: EP4CE6E22C8N (U1.58), DDR_HDMI (U7.37)
59: EP4CE6E22C8N (U1.59), DDR_HDMI (U7.35)
60: EP4CE6E22C8N (U1.60), DDR_HDMI (U7.34)
64: EP4CE6E22C8N (U1.64), DDR_HDMI (U7.33)
65: EP4CE6E22C8N (U1.65), DDR_HDMI (U7.32)
66: EP4CE6E22C8N (U1.66), DDR_HDMI (U7.31)
67: EP4CE6E22C8N (U1.67), DDR_HDMI (U7.30)
68: EP4CE6E22C8N (U1.68), DDR_HDMI (U7.29)
69: EP4CE6E22C8N (U1.69), DDR_HDMI (U7.16)
70: EP4CE6E22C8N (U1.70), DDR_HDMI (U7.17)
71: EP4CE6E22C8N (U1.71), DDR_HDMI (U7.18)
72: EP4CE6E22C8N (U1.72), DDR_HDMI (U7.19)
73: EP4CE6E22C8N (U1.73), DDR_HDMI (U7.20)
74: EP4CE6E22C8N (U1.74), DDR_HDMI (U7.21)
75: EP4CE6E22C8N (U1.75), DDR_HDMI (U7.22)
76: EP4CE6E22C8N (U1.76), DDR_HDMI (U7.23)
77: EP4CE6E22C8N (U1.77), DDR_HDMI (U7.24)
80: EP4CE6E22C8N (U1.80), DDR_HDMI (U7.25)
83: EP4CE6E22C8N (U1.83), DDR_HDMI (U7.26)
104: EP4CE6E22C8N (U1.104), DDR_HDMI (Q2.2 R36.1)
105: EP4CE6E22C8N (U1.105), DDR_HDMI (Q1.2 R33.1)
106: EP4CE6E22C8N (U1.106), DDR_HDMI (R29.2 R30.1)
110: EP4CE6E22C8N (U1.110), Peripheral (JP1.28 R42.2 U8.6 U9.6)
112: EP4CE6E22C8N (U1.112), Peripheral (JP1.25 LCD1.5)
113: EP4CE6E22C8N (U1.113), Peripheral (JP1.26 R41.2 U8.5 U9.1)
114: EP4CE6E22C8N (U1.114), Peripheral (JP1.23 LCD1.6)
115: EP4CE6E22C8N (U1.115), Peripheral (JP1.24 LCD1.4)
119: EP4CE6E22C8N (U1.119), Peripheral (JP1.21 Q3.1 R50.2)
120: EP4CE6E22C8N (U1.120), Peripheral (JP1.22 LCD1.3)
121: EP4CE6E22C8N (U1.121), Peripheral (JP1.19)
124: EP4CE6E22C8N (U1.124), Peripheral (JP1.15)
125: EP4CE6E22C8N (U1.125), Peripheral (JP1.20)
126: EP4CE6E22C8N (U1.126), Peripheral (JP1.18)
127: EP4CE6E22C8N (U1.127), Peripheral (JP1.16)
128: EP4CE6E22C8N (U1.128), Peripheral (JP1.17)
129: EP4CE6E22C8N (U1.129), Peripheral (JP1.13)
132: EP4CE6E22C8N (U1.132), Peripheral (JP1.14)
133: EP4CE6E22C8N (U1.133), Peripheral (JP1.11)
135: EP4CE6E22C8N (U1.135), Peripheral (JP1.12)
136: EP4CE6E22C8N (U1.136), Peripheral (JP1.9)
137: EP4CE6E22C8N (U1.137), Peripheral (JP1.10)
138: EP4CE6E22C8N (U1.138), Peripheral (JP1.7)
141: EP4CE6E22C8N (U1.141), Peripheral (JP1.8)
142: EP4CE6E22C8N (U1.142), Peripheral (JP1.5)
143: EP4CE6E22C8N (U1.143), Peripheral (JP1.6)
144: EP4CE6E22C8N (U1.144), Peripheral (LED5.2)
DIFFIO_R3_N: EP4CE6E22C8N (U1.101), DDR_HDMI (R27.2)
DIFFIO_R3_P: EP4CE6E22C8N (U1.103), DDR_HDMI (R28.2)
DIFFIO_R4_N: EP4CE6E22C8N (U1.98), DDR_HDMI (R25.2)
DIFFIO_R4_P: EP4CE6E22C8N (U1.99), DDR_HDMI (R26.2)
DIFFIO_R7_N: EP4CE6E22C8N (U1.86), DDR_HDMI (R23.2)
DIFFIO_R7_P: EP4CE6E22C8N (U1.87), DDR_HDMI (R24.2)
DIFFIO_R8_N: EP4CE6E22C8N (U1.84), DDR_HDMI (R21.2)
DIFFIO_R8_P: EP4CE6E22C8N (U1.85), DDR_HDMI (R22.2)
JTAG_TCK: EP4CE6E22C8N (U1.16), USB_Blaster (R51.1 U11.3)
JTAG_TDI: EP4CE6E22C8N (U1.15), USB_Blaster (R53.1 U11.6)
JTAG_TDO: EP4CE6E22C8N (U1.20), USB_Blaster (U11.12)
JTAG_TMS: EP4CE6E22C8N (U1.18), USB_Blaster (R52.1 R68.1 U11.8)
PIC_USB_DN: Power (U6.1), USB_Blaster (U10.18)
PIC_USB_DP: Power (U5.1), USB_Blaster (U10.19)